# EAGLE design nRF52832_qfaa_nfc (EAGLE 8.3.0)
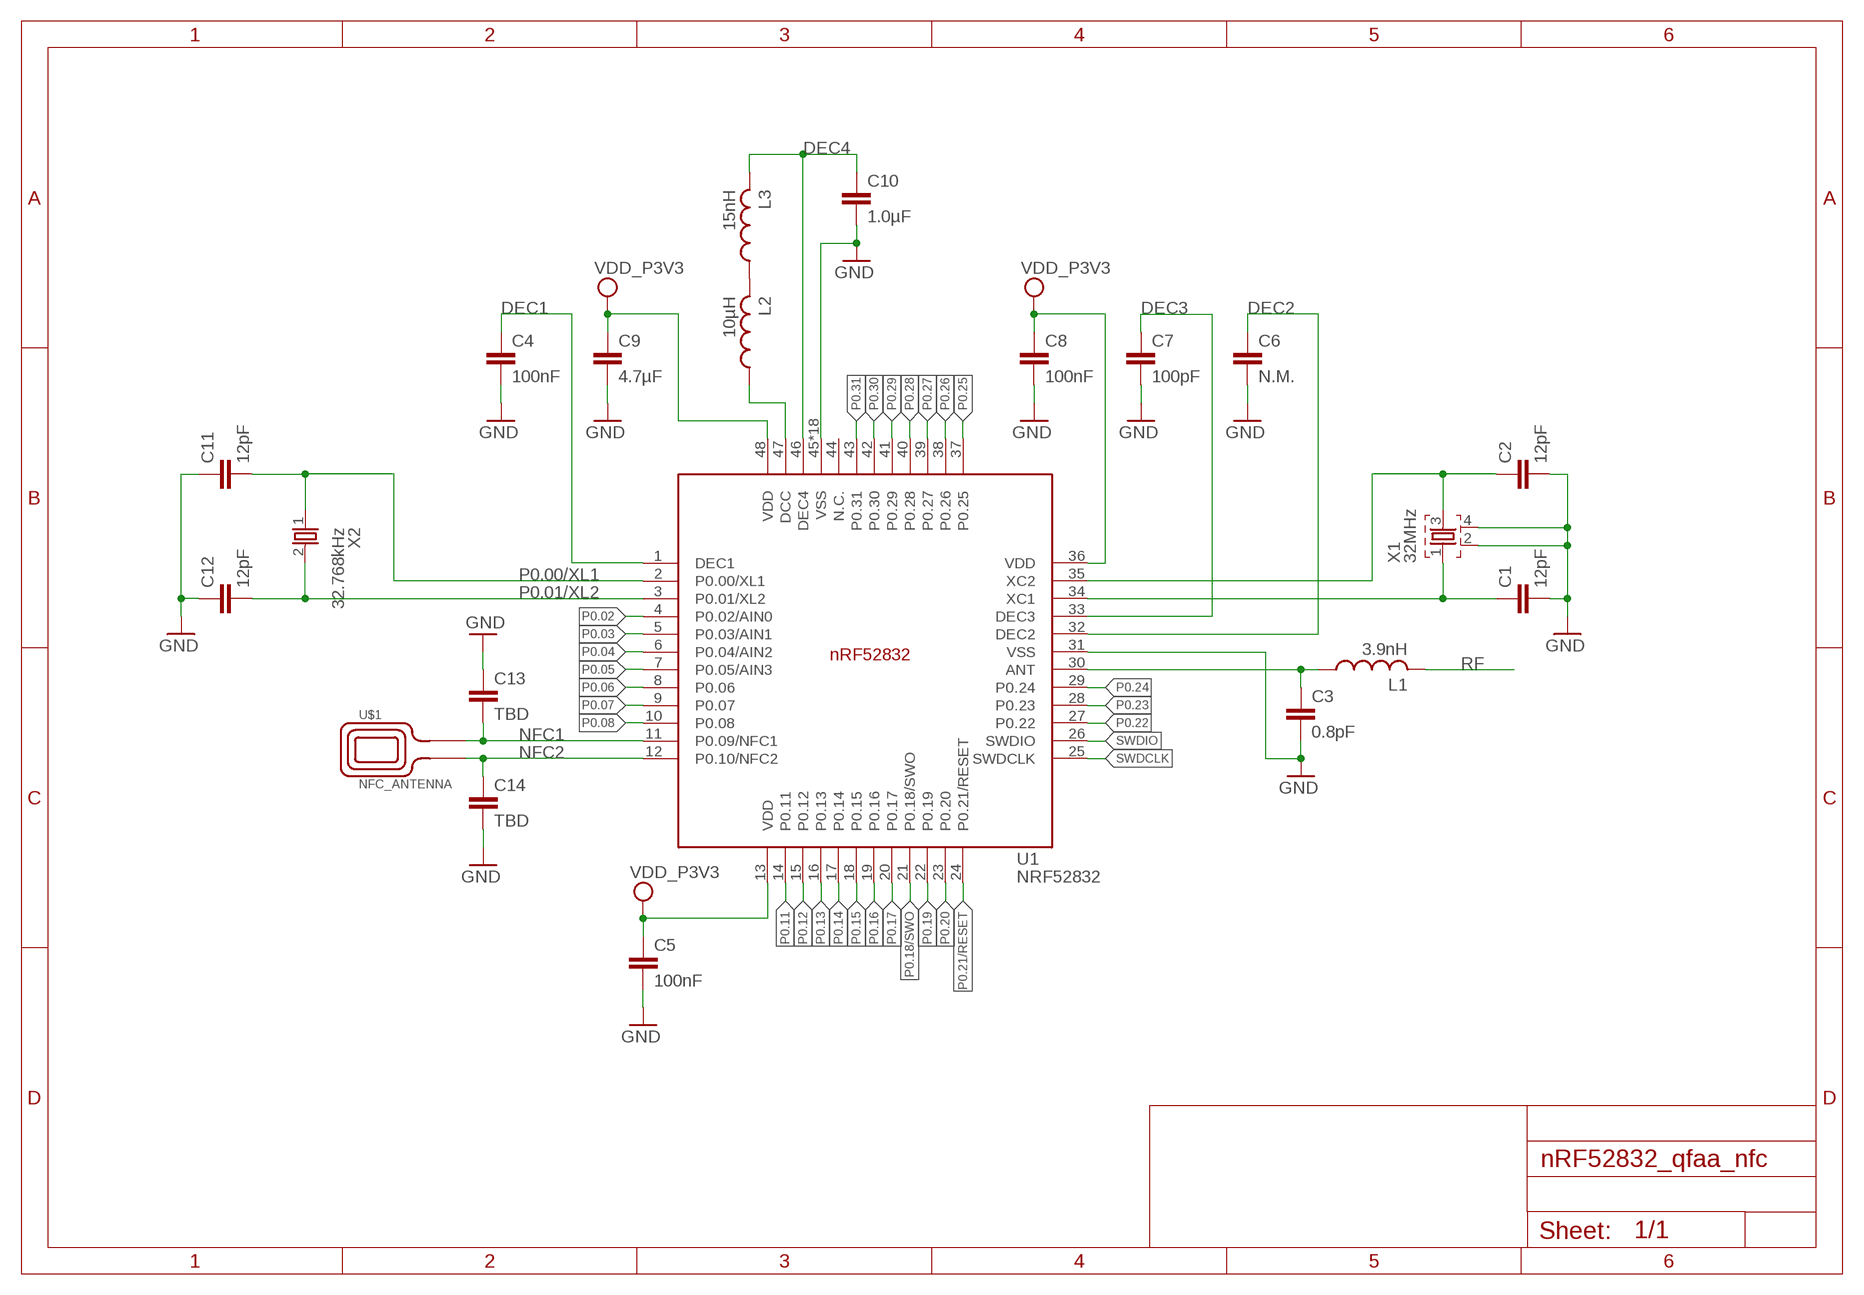
[diagram p0: schematic, sheet 1]

## Parts
C1  12pF  CAPACITOR_0402_N  [RESC0402_N]
C2  12pF  CAPACITOR_0402_N  [RESC0402_N]
C3  0.8pF  CAPACITOR_0402_N  [RESC0402_N]
C4  100nF  CAPACITOR_0402_N  [RESC0402_N]
C5  100nF  CAPACITOR_0402_N  [RESC0402_N]
C6  N.M.  CAPACITOR_0402_N  [RESC0402_N]
C7  100pF  CAPACITOR_0402_N  [RESC0402_N]
C8  100nF  CAPACITOR_0402_N  [RESC0402_N]
C9  4.7µF  CAPACITOR_0603_N  [RESC0603_N]
C10  1.0µF  CAPACITOR_0603_N  [RESC0603_N]
C11  12pF  CAPACITOR_0402_N  [RESC0402_N]
C12  12pF  CAPACITOR_0402_N  [RESC0402_N]
C13  TBD  CAPACITOR_0402_N  [RESC0402_N]
C14  TBD  CAPACITOR_0402_N  [RESC0402_N]
L1  3.9nH  INDUCTOR_0402_N  [RESC0402_N]
L2  10µH  INDUCTOR_0603_N  [RESC0603_N]
L3  15nH  INDUCTOR_0402_N  [RESC0402_N]
U1  NRF52832  [QFN40P600X600X90-48_N]
U$1  NFC_ANTENNA  [NFC_ANT]
X1  32MHz  XTAL_32MHZ  [BT-XTAL_2016_N]
X2  32.768kHz  XTAL_32KHZ  [XTAL_3215_N]

## Nets
ANT: C3.1 L1.1 U1.30(ANT)
DEC1: C4.1 U1.1(DEC1)
DEC2: C6.1 U1.32(DEC2)
DEC3: C7.1 U1.33(DEC3)
DEC4: C10.1 L3.2 U1.46(DEC4)
GND: C1.2 C2.2 C3.2 C4.2 C5.2 C6.2 C7.2 C8.2 C9.2 C10.2 C11.1 C12.1 C13.1 C14.2 U1.31(VSS) U1.45(VSS) U1.PAD(VSS) U1.PAD@VIA01(VSS) U1.PAD@VIA02(VSS) U1.PAD@VIA03(VSS) U1.PAD@VIA04(VSS) U1.PAD@VIA05(VSS) U1.PAD@VIA06(VSS) U1.PAD@VIA07(VSS) U1.PAD@VIA08(VSS) U1.PAD@VIA09(VSS) U1.PAD@VIA10(VSS) U1.PAD@VIA11(VSS) U1.PAD@VIA12(VSS) U1.PAD@VIA13(VSS) U1.PAD@VIA14(VSS) U1.PAD@VIA15(VSS) U1.PAD@VIA16(VSS) X1.2 X1.4
N$2: L2.2 L3.1
N$3: C2.1 U1.35(XC2) X1.3
N$4: L2.1 U1.47(DCC)
NFC1: C13.2 U1.11(P0.09/NFC1) U$1.2
NFC2: C14.1 U1.12(P0.10/NFC2) U$1.1
P0.00/XL1: C11.2 U1.2(P0.00/XL1) X2.1
P0.01/XL2: C12.2 U1.3(P0.01/XL2) X2.2
P0.02: U1.4(P0.02/AIN0)
P0.03: U1.5(P0.03/AIN1)
P0.04: U1.6(P0.04/AIN2)
P0.05: U1.7(P0.05/AIN3)
P0.06: U1.8(P0.06)
P0.07: U1.9(P0.07)
P0.08: U1.10(P0.08)
P0.11: U1.14(P0.11)
P0.12: U1.15(P0.12)
P0.13: U1.16(P0.13)
P0.14: U1.17(P0.14)
P0.15: U1.18(P0.15)
P0.16: U1.19(P0.16)
P0.17: U1.20(P0.17)
P0.18/SWO: U1.21(P0.18/SWO)
P0.19: U1.22(P0.19)
P0.20: U1.23(P0.20)
P0.21/RESET: U1.24(P0.21/RESET)
P0.22: U1.27(P0.22)
P0.23: U1.28(P0.23)
P0.24: U1.29(P0.24)
P0.25: U1.37(P0.25)
P0.26: U1.38(P0.26)
P0.27: U1.39(P0.27)
P0.28: U1.40(P0.28)
P0.29: U1.41(P0.29)
P0.30: U1.42(P0.30)
P0.31: U1.43(P0.31)
RF: L1.2
SWDCLK: U1.25(SWDCLK)
SWDIO: U1.26(SWDIO)
VDD_P3V3: C5.1 C8.1 C9.1 U1.13(VDD) U1.36(VDD) U1.48(VDD)
X1: C1.1 U1.34(XC1) X1.1
Unconnected: U1.44(N.C.)

## Library data of the parts
C1-C14 = Nordic_nRF:CAPACITOR: Generic chip capacitor
L1-L3 = Nordic_nRF:INDUCTOR: Generic chip inductor
U1 = Nordic_nRF:NRF52832: nRF52832 Features Single chip, highly flexible, 2.4 GHz multi-protocol SoC 32-bit ARM Cortex-M4F Processor 1.7v to 3.6v operation 512kB flash + 64kB RAM Supports concurrent Bluetooth Smart/ANT protocol operation On-chip NFC tag for Out-of-Band (OOB) pairing Up to +4dBm output power -96dBm sensitivity, Bluetooth Smart Thread safe and run-time protected Event driven API On air compatible with nRF24L and nRF24AP series 2 data rates (2Mbps/1Mbps) PPI - maximum flexibility for power-efficient applications and code simplification Automated power management system with automatic power management of each peripheral Configurable I/O mapping for analog and digital I/O 3 x Master/Slave SPI 2 x Two-wire interface (I²C) UART (RTS/CTS) 3 x PWM AES HW encryption Real Time Counter (RTC) Digital microphone interface (PDM) On-chip balun Applications Internet of Things (IoT) Wearables SmartHome sensors Connected white goods Computer peripherals Voice-command smart remotes A4WP ‘Rezence’ wireless charging Beacons Sports and fitness sensors and hubs Connected health products Smart watches RC Toys Interactive games Building automation and sensor networks
U$1 = Nordic_misc:NFC_ANTENNA
X1 = Nordic_nRF:XTAL_32MHZ
X2 = Nordic_nRF:XTAL_32KHZ

## Board
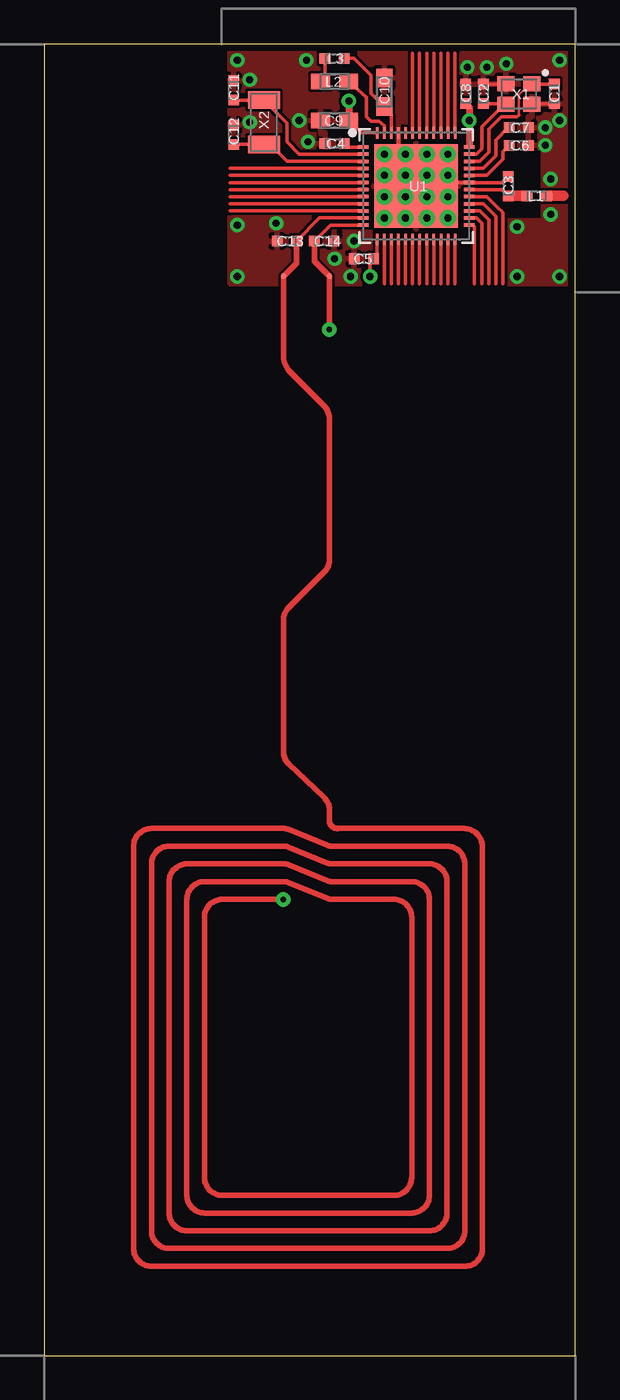
[diagram p1: board, top side]
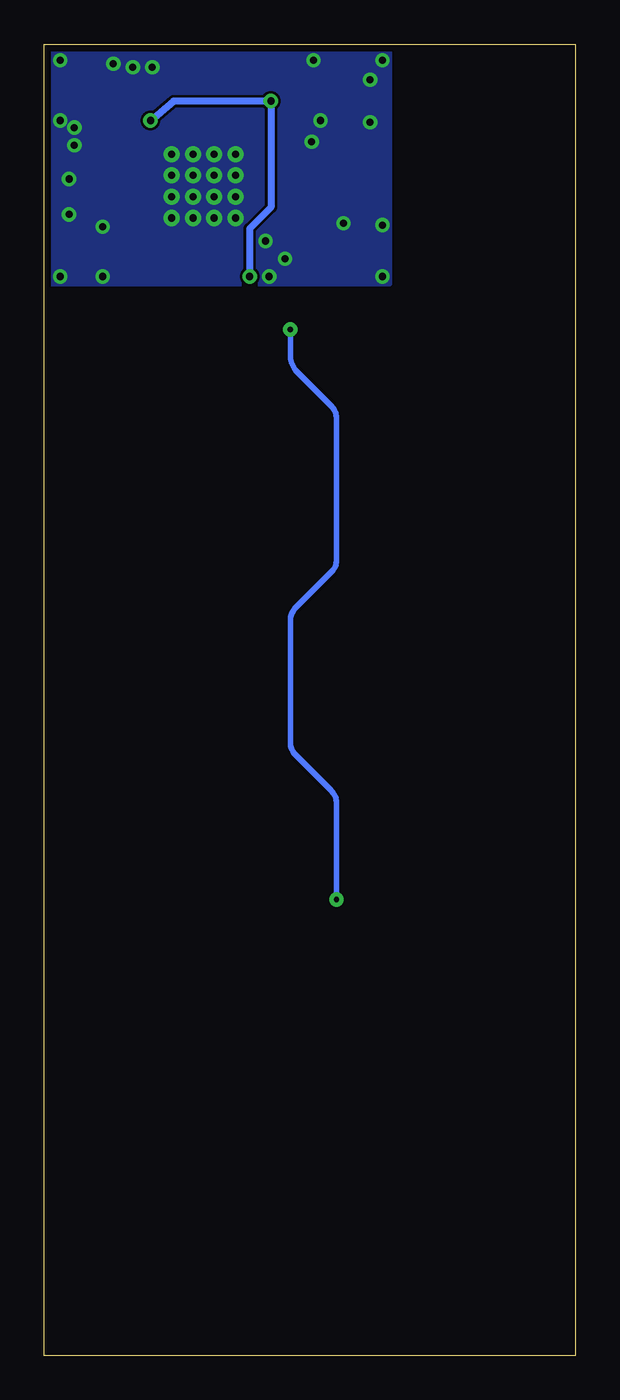
[diagram p2: board, bottom side, seen from below]

Size 30 x 74 mm. Coordinates in mm from the lower left corner, seen from the top.
Outline: 0,0 30,0 30,74 0,74 0,0
Copper layers (1*16): Top 0.035mm / dielectric 1.5mm / Bottom 0.035mm
Design rules "Nordic": minimum track width 0.15mm, minimum drill 0.4mm, track to track 0.15mm, track to pad 0.15mm, pad to pad 0.15mm, via to via 0.15mm, smd to smd 0.15mm, copper to edge 0.4mm, drill to drill 0.4mm, minimum pad ring 10mil, minimum via ring 8mil, stop-mask expansion 4mil, vias tented up to drill 0mil, thermal gap 0.2mm
tRestrict: area 24.4,64.2 to 28,68

### Footprints (pad centres in the part's own frame; a part is rotated, then mirrored left to right if it is on the bottom)
RESC0402_N = smd 0.6 x 0.6: 1 -0.55,0; 2 0.55,0
RESC0603_N = smd 1.05 x 0.9: 1 -0.8,0; 2 0.8,0
QFN40P600X600X90-48_N = smd 0.65 x 0.2: 1 -3,2.2; 2 -3,1.8; 3 -3,1.4; 4 -3,1; 5 -3,0.6; 6 -3,0.2; 7 -3,-0.2; 8 -3,-0.6; 9 -3,-1; 10 -3,-1.4; 11 -3,-1.8; 12 -3,-2.2; 25 3,-2.2; 26 3,-1.8; 27 3,-1.4; 28 3,-1; 29 3,-0.6; 30 3,-0.2; 31 3,0.2; 32 3,0.6; 33 3,1; 34 3,1.4; 35 3,1.8; 36 3,2.2 | smd 0.2 x 0.65: 13 -2.2,-3; 14 -1.8,-3; 15 -1.4,-3; 16 -1,-3; 17 -0.6,-3; 18 -0.2,-3; 19 0.2,-3; 20 0.6,-3; 21 1,-3; 22 1.4,-3; 23 1.8,-3; 24 2.2,-3; 37 2.2,3; 38 1.8,3; 39 1.4,3; 40 1,3; 41 0.6,3; 42 0.2,3; 43 -0.2,3; 44 -0.6,3; 45 -1,3; 46 -1.4,3; 47 -1.8,3; 48 -2.2,3 | smd 4.7 x 4.7: PAD 0,0 | drill 0.4: PAD@VIA01 -1.8,1.8; PAD@VIA02 -1.8,0.6; PAD@VIA03 -1.8,-0.6; PAD@VIA04 -1.8,-1.8; PAD@VIA05 -0.6,1.8; PAD@VIA06 -0.6,0.6; PAD@VIA07 -0.6,-0.6; PAD@VIA08 -0.6,-1.8; PAD@VIA09 0.6,1.8; PAD@VIA10 0.6,0.6; PAD@VIA11 0.6,-0.6; PAD@VIA12 0.6,-1.8; PAD@VIA13 1.8,1.8; PAD@VIA14 1.8,0.6; PAD@VIA15 1.8,-0.6; PAD@VIA16 1.8,-1.8
NFC_ANT = smd 0.3 x 0.3: 1 0,0; 2 0,-2.6 | drill 0.3 pad 0.6: P$1 3,0; P$2 35.15,-2.6
BT-XTAL_2016_N = smd 0.95 x 0.85: 1 -0.725,-0.575; 2 0.725,-0.575; 3 0.725,0.575; 4 -0.725,0.575
XTAL_3215_N = smd 1 x 1.8: 1 -1.25,0; 2 1.25,0

### Placement (x,y rotation side)
C1  28.8,71.2 270 top
C2  24.8,71.2 90 top
C3  26.2,66 90 top
C4  16.4,68.4 180 top
C5  18.05,61.9 180 top
C6  26.8,68.3 0 top
C7  26.8,69.3 0 top
C8  23.8,71.2 90 top
C9  16.4,69.7 180 top
C10  19.2,71.3 90 top
C11  10.7,71.4 270 top
C12  10.7,68.9 270 top
C13  13.7,62.9 0 top
C14  15.8,62.9 0 top
L1  27.8,65.45 0 top
L2  16.4,71.9 180 top
L3  16.4,73.2 0 top
U1  21,66 0 top
U$1  16.1,60.9 270 top
X1  26.8,71.2 180 top
X2  12.4,69.6 270 top

### Tracks (layer width: path | path; a pad name or v marks a point on that pad's centre or on a via)
ANT
  Top 0.2: U1.30 25.85,65.8 C3.1 26.25,65.45
  Top 0.6: L1.1 26.25,65.45
DEC1
  Top 0.2: U1.1 17.15,68.2 C4.1
DEC2
  Top 0.2: U1.32 25,66.6 25.6,67.2 25.9,67.5 25.9,67.7 25.9,67.95 C6.1
DEC3
  Top 0.2: U1.33 24.8,67 25.2,67.4 25.5,67.7 25.5,68.6 26.15,69.25 C7.1
DEC4
  Top 0.2: U1.46 19.6,70 C10.1 18.45,71.25 18.45,71.45 18.45,72.25 17.5,73.2 L3.2
GND  (via drill 0.4 pad 0.8)
  Top 0.2: 22.85,66.19 U1.31 25.85,66.2 C3.2 | 22.85,66.19 arc-90 U1.PAD@VIA14 | 20.05,67.99 arc90 U1.PAD@VIA05 | U1.PAD@VIA01 20,67.8 | 20,67.8 U1.PAD@VIA05 | U1.PAD@VIA05 U1.PAD@VIA09 U1.PAD@VIA13 U1.PAD@VIA14 | U1.PAD@VIA02 U1.PAD@VIA06 | U1.PAD@VIA06 U1.PAD@VIA10 U1.PAD@VIA14 | 22.85,66.19 22.85,65.79 arc-90 U1.PAD@VIA15 | U1.PAD@VIA15 U1.PAD@VIA16 U1.PAD@VIA12 | U1.PAD@VIA15 U1.PAD@VIA11 U1.PAD@VIA07 U1.PAD@VIA03 U1.PAD@VIA04 U1.PAD@VIA08 | U1.PAD@VIA06 arc90 U1.PAD | U1.45 20,67.8 | C1.2 27.55,70.65 X1.4 | C2.2 26.05,71.75 X1.2 | 15.85,69.45 C9.2
  other vias: 11.6,69.6 11.6,72 14.4,69.7 23.9,72.7 28.3,69.3 28.3,68.3 14.9,68.5 29.1,69.7 26.1,72.9 25,72.7 17.3,60.9 17.5,62.9 28.6,64.4 28.6,66.4 10.9,73.1 14.8,73.1 29.1,73.1 26.7,63.7 29.1,60.9 26.7,60.9 16.4,61.9 10.9,60.9 10.9,63.8 13.1,63.9
  pour Top: 10.5,60.5 10.5,74 30,74 30,60.5
  pour Bottom: 10.5,60.5 10.5,74 30,74 30,60.5
N$2
  Top 0.2: L3.1 15.85,71.9 L2.2
N$3
  Top 0.2: U1.35 24.4,67.8 24.7,68.1 24.7,68.9 24.7,69.35 26,70.65 | C2.1 26,70.65 | 26,70.65 26.05,70.65 X1.3
N$4
  Top 0.2: U1.47 19.2,69.4 18.9,69.65 18.45,69.65 18.2,69.9 18.2,71 L2.1
NFC1
  Top 0.2: U1.11 15.55,64.2 C13.2
  Top 0.3: C13.2 14.25,61.65 U$1.2
NFC2
  Top 0.2: U1.12 16.15,63.8 C14.1
  Top 0.3: C14.1 15.25,61.75 U$1.1
P0.00/XL1
  Top 0.2: C11.2 X2.1 13.7,69.55 13.7,68.5 14.4,67.8 U1.2
P0.01/XL2
  Top 0.2: C12.2 X2.2 12.65,68.1 13,68.1 13.7,67.4 U1.3
P0.02
  Top 0.2: U1.4 10.5,67
P0.03
  Top 0.2: U1.5 10.5,66.6
P0.04
  Top 0.2: U1.6 10.5,66.2
P0.05
  Top 0.2: U1.7 10.5,65.8
P0.06
  Top 0.2: U1.8 10.5,65.4
P0.07
  Top 0.2: U1.9 10.5,65
P0.08
  Top 0.2: U1.10 10.5,64.6
P0.11
  Top 0.2: U1.14 19.2,60.5
P0.12
  Top 0.2: U1.15 19.6,60.5
P0.13
  Top 0.2: U1.16 20,60.5
P0.14
  Top 0.2: U1.17 20.4,60.5
P0.15
  Top 0.2: U1.18 20.8,60.5
P0.16
  Top 0.2: U1.19 21.2,60.5
P0.17
  Top 0.2: U1.20 21.6,60.5
P0.18/SWO
  Top 0.2: U1.21 22,60.5
P0.19
  Top 0.2: U1.22 22.4,60.5
P0.20
  Top 0.2: U1.23 22.8,60.5
P0.21/RESET
  Top 0.2: U1.24 23.2,60.5
P0.22
  Top 0.2: U1.27 24.6,64.6 25.1,64.1 25.1,60.5
P0.23
  Top 0.2: U1.28 24.8,65 24.9,64.9 25.5,64.3 25.5,60.5
P0.24
  Top 0.2: U1.29 25,65.4 25.7,64.7 25.8,64.6 25.9,64.5 25.9,60.5
P0.25
  Top 0.2: U1.37 23.2,73.5
P0.26
  Top 0.2: U1.38 22.8,73.5
P0.27
  Top 0.2: U1.39 22.4,73.5
P0.28
  Top 0.2: U1.40 22,73.5
P0.29
  Top 0.2: U1.41 21.6,73.5
P0.30
  Top 0.2: U1.42 21.2,73.5
P0.31
  Top 0.2: U1.43 20.8,73.5
RF
  Top 0.6: L1.2 29.3,65.45
SWDCLK
  Top 0.2: U1.25 24.2,63.8 24.3,63.7 24.3,60.5
SWDIO
  Top 0.2: U1.26 24.4,64.2 24.7,63.9 24.7,60.5
VDD_P3V3  (via drill 0.4 pad 0.8)
  Top 0.2: U1.48 17.9,69 C9.1 | U1.36 24,68.3 | U1.13 18.8,61.9 C5.1 18.4,61.9 v18.4,60.9
  Top 0.4: 24,68.3 v24,69.7 24,70.45 C8.1 | v17.2,70.8 C9.1
  Bottom 0.4: v18.4,60.9 18.4,63.6 17.2,64.8 v17.2,70.8 22.7,70.8 v24,69.7
X1
  Top 0.15: 26.8,70 26.8,71.15 27.43,71.78 X1.1
  Top 0.2: C1.1 27.55,71.75 X1.1 | U1.34 24.6,67.4 25,67.8 25.1,67.9 25.1,68.7 25.1,69.2 25.8,69.9 26.7,69.9 26.8,70